# Altium schematic sheet AMPURR.SchDoc: =DocumentName
size 420 x 297 mm; CompanyName: "AS Manufacturing" LLC; Organization: "AS Manufacturing" LLC; Address1: 5 Sklyarenka St.; Address2: Kyiv 04073; Address3: Ukraine; Address4: https://ajax.systems/en/; DocumentNumber: 3; SheetNumber: 3; SheetTotal: 6; Template_version: 1.0.1
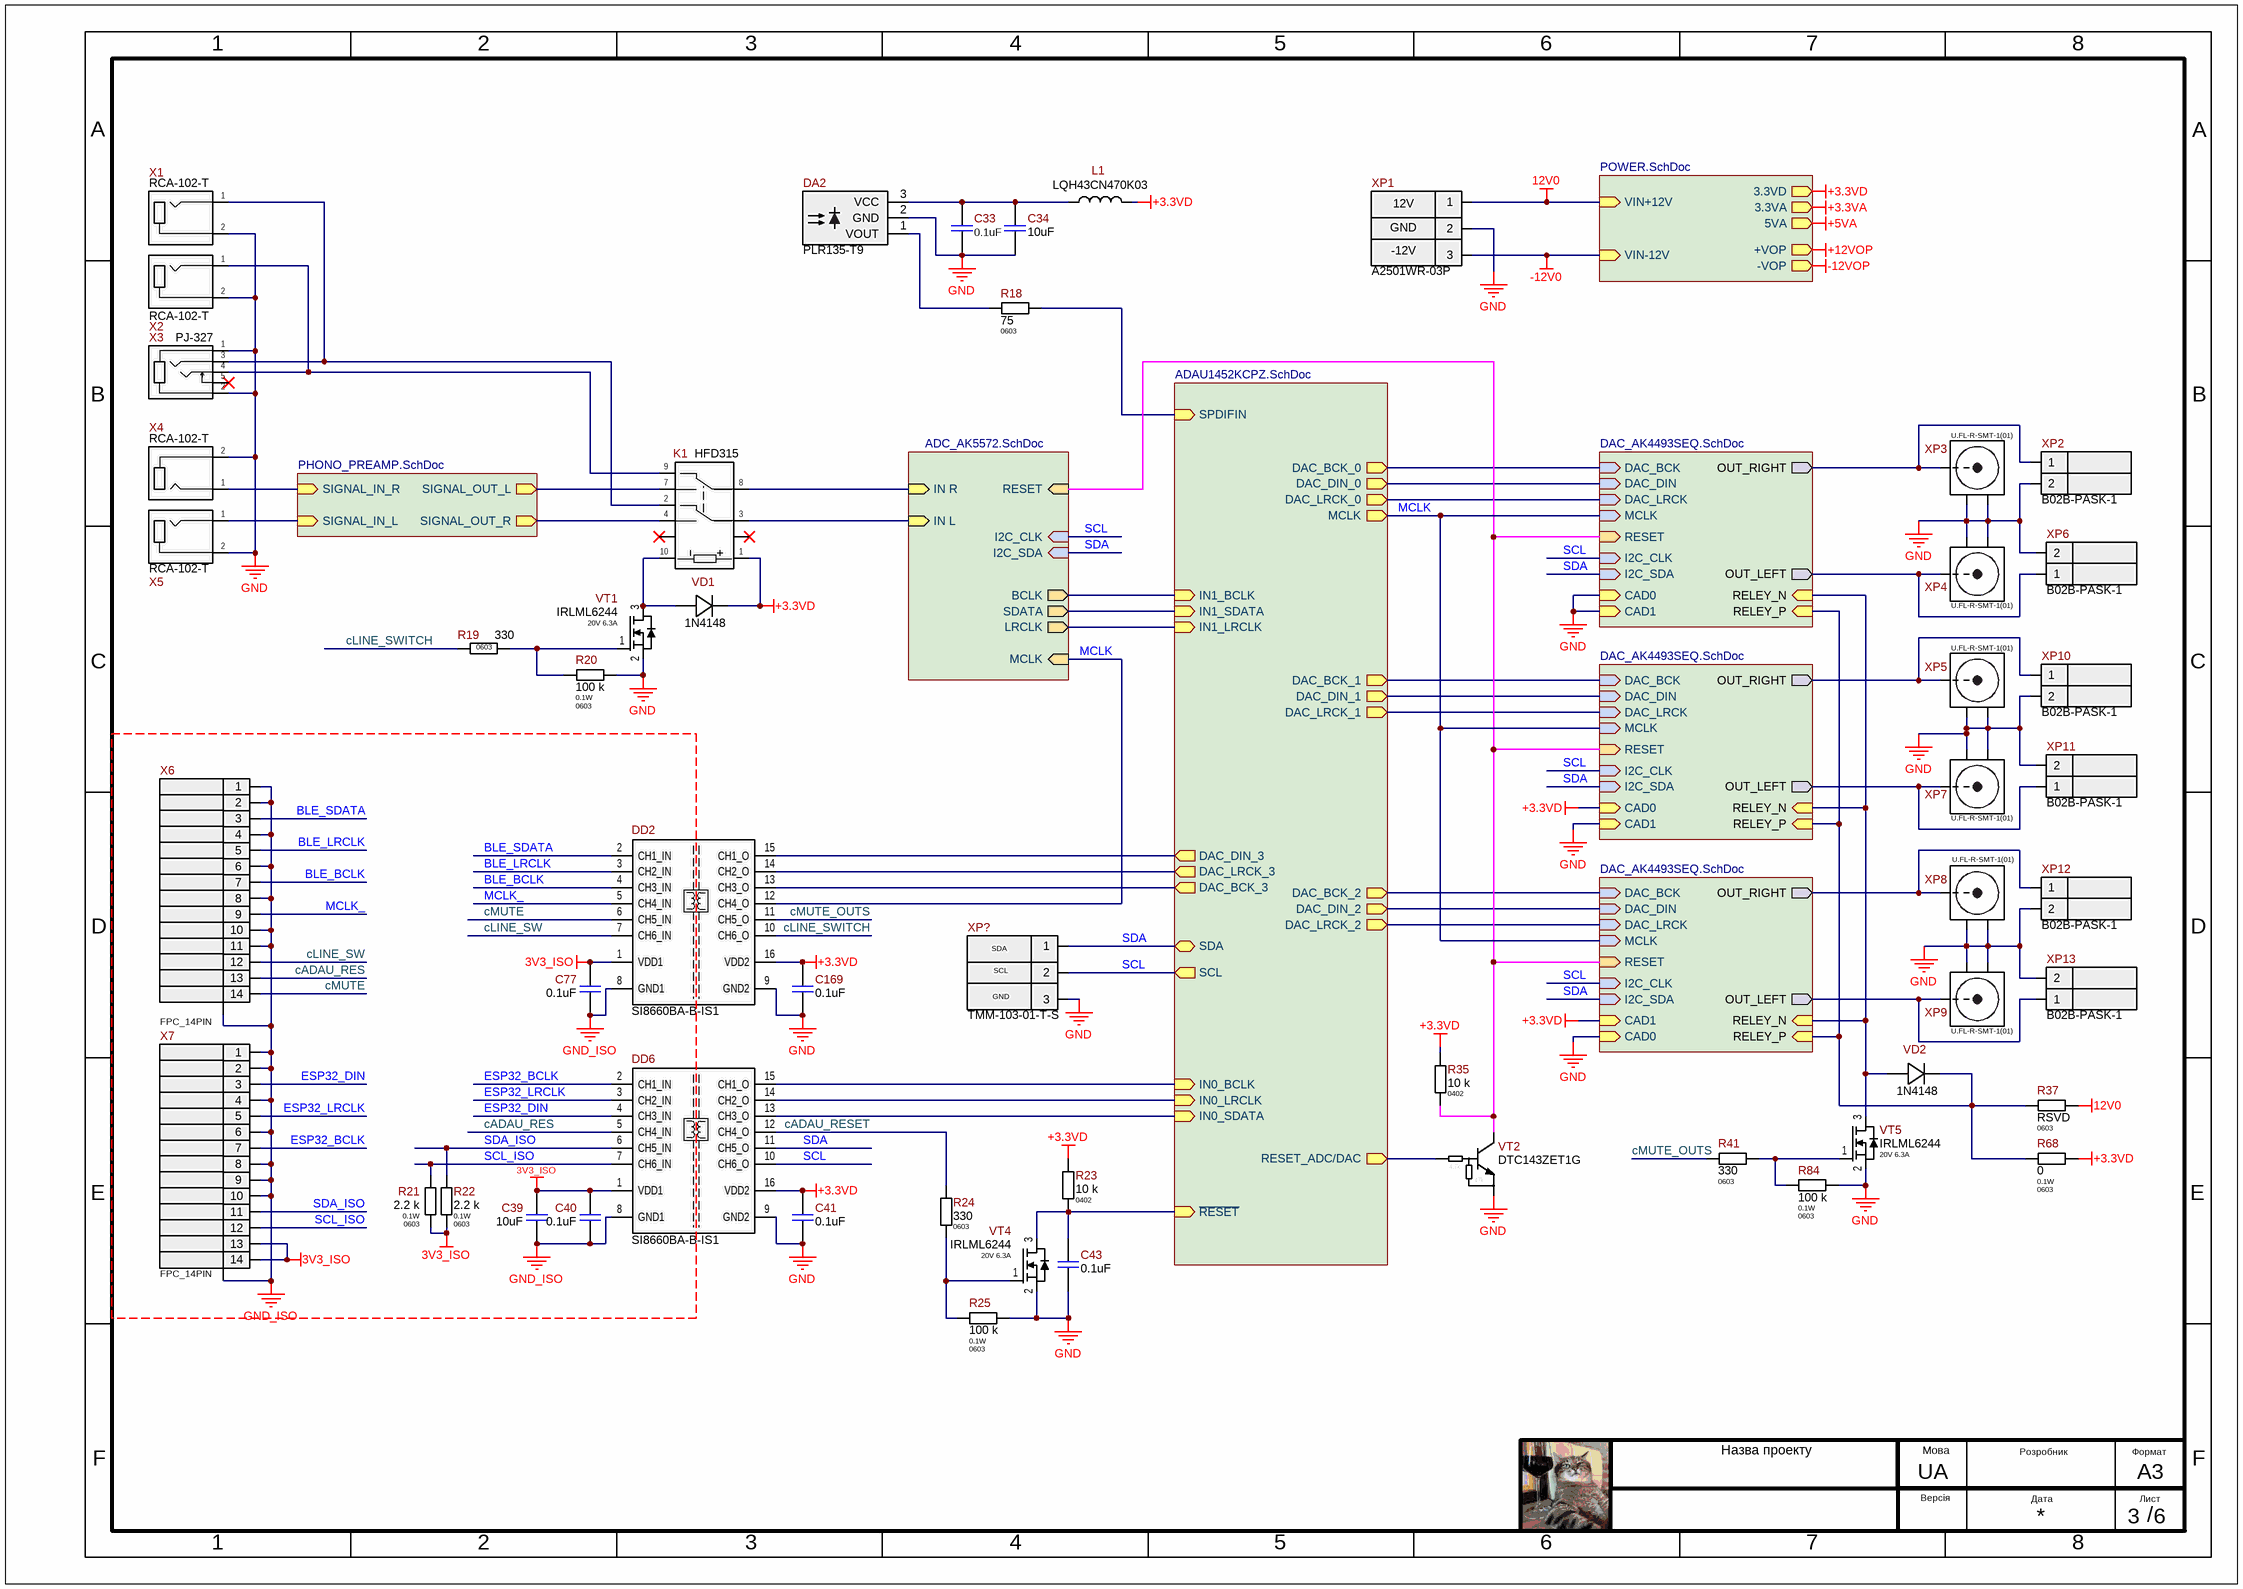
[diagram p0: AMPURR.SchDoc]

## Parts
C33  0.1uF  [C0603(1608)]
C34  10uF  [C0603(1608)]
C39  10uF  [C0402(1005)]
C40  0.1uF  [C0402(1005)]
C41  0.1uF  [C0402(1005)]
C43  0.1uF  [C0402(1005)]
C77  0.1uF  [C0402(1005)]
C169  0.1uF  [C0402(1005)]
DA2  PLR135-T9  [PLR135-T9]
DD2  SI8660BA-B-IS1  [SOIC-16]
DD6  SI8660BA-B-IS1  [SOIC-16]
K1  HFD315  [HFD315]
L1  LQH43CN470K03  [LQH43C]
R18  75  Package/Case: 0603  [R0603]
R19  330  Package/Case: 0603  [R0603]
R20  100 k  Power Rating: 0.1W  Package/Case: 0603  [R0603]
R21  2.2 k  Power Rating: 0.1W  Package/Case: 0603  [R0603]
R22  2.2 k  Power Rating: 0.1W  Package/Case: 0603  [R0603]
R23  10 k  Package/Case: 0402  [R0402]
R24  330  Package/Case: 0603  [R0603]
R25  100 k  Power Rating: 0.1W  Package/Case: 0603  [R0603]
R35  10 k  Package/Case: 0402  [R0402]
R37  RSVD  Package/Case: 0603  [R0603]  (no BOM)
R41  330  Package/Case: 0603  [R0603]
R68  0  Power Rating: 0.1W  Package/Case: 0603  [R0603]
R84  100 k  Power Rating: 0.1W  Package/Case: 0603  [R0603]
VD1  1N4148  [D0805]
VD2  1N4148  [D0805]
VT1  IRLML6244  Power Rating: 20V 6.3A  [SOT-23]
VT2  DTC143ZET1G  [SOT-416]
VT4  IRLML6244  Power Rating: 20V 6.3A  [SOT-23]
VT5  IRLML6244  Power Rating: 20V 6.3A  [SOT-23]
X1  RCA-102-T  [RCA-102-T]
X2  RCA-102-T  [RCA-102-T]
X3  PJ-327  [PJ-327A]
X4  RCA-102-T  [RCA-102-T]
X5  RCA-102-T  [RCA-102-T]
X6  FPC_14PIN  [FPC-14-0.5mm]
X7  FPC_14PIN  [FPC-14-0.5mm]
XP1  A2501WR-03P  [A2501WR-03P]
XP2  B02B-PASK-1  [JST_B02B-PASK-1(LF)(SN)]
XP3  U.FL-R-SMT-1(01)  [IPEX_ RECE.20279.001E.01]
XP4  U.FL-R-SMT-1(01)  [IPEX_ RECE.20279.001E.01]
XP5  U.FL-R-SMT-1(01)  [IPEX_ RECE.20279.001E.01]
XP6  B02B-PASK-1  [JST_B02B-PASK-1(LF)(SN)]
XP7  U.FL-R-SMT-1(01)  [IPEX_ RECE.20279.001E.01]
XP8  U.FL-R-SMT-1(01)  [IPEX_ RECE.20279.001E.01]
XP9  U.FL-R-SMT-1(01)  [IPEX_ RECE.20279.001E.01]
XP10  B02B-PASK-1  [JST_B02B-PASK-1(LF)(SN)]
XP11  B02B-PASK-1  [JST_B02B-PASK-1(LF)(SN)]
XP12  B02B-PASK-1  [JST_B02B-PASK-1(LF)(SN)]
XP13  B02B-PASK-1  [JST_B02B-PASK-1(LF)(SN)]
XP?  TMM-103-01-T-S  [CON_3_Pitch_2mm_1_Rows]

## Sub-sheets
U_ADAU1452KCPZ = ADAU1452KCPZ.SchDoc: DAC_DIN_0 (out), DAC_BCK_0 (out), DAC_LRCK_0 (out), DAC_DIN_1 (out), DAC_BCK_1 (out), DAC_LRCK_1 (out), DAC_DIN_2 (out), DAC_BCK_2 (out), DAC_LRCK_2 (out), IN0_BCLK (in), IN0_LRCLK (in), IN0_SDATA (in), IN1_BCLK (in), IN1_LRCLK (in), IN1_SDATA (in), MCLK (out), SCL (out), SDA (bidir), ~{RESET} (in), SPDIFIN (in), RESET_ADC/DAC (out), DAC_DIN_3 (out), DAC_BCK_3 (out), DAC_LRCK_3 (out)
U_ADC_AK5572 = ADC_AK5572.SchDoc: MCLK (in), IN L (in), SDATA (out), LRCLK (out), BCLK (out), IN R (in), RESET (in), I2C_SDA (in), I2C_CLK (in)
U_DAC_AK4493SEQ = DAC_AK4493SEQ.SchDoc: DAC_BCK (in), DAC_DIN (in), DAC_LRCK (in), MCLK (in), OUT_RIGHT (out), OUT_LEFT (out), RESET (in), I2C_SDA (in), I2C_CLK (in), CAD0 (in), CAD1 (in), RELEY_N (in), RELEY_P (in)
U_DAC_AK4493SEQ = DAC_AK4493SEQ.SchDoc: DAC_BCK (in), DAC_DIN (in), DAC_LRCK (in), MCLK (in), OUT_RIGHT (out), OUT_LEFT (out), RESET (in), I2C_SDA (in), I2C_CLK (in), CAD0 (in), CAD1 (in), RELEY_N (in), RELEY_P (in)
U_DAC_AK4493SEQ = DAC_AK4493SEQ.SchDoc: DAC_BCK (in), DAC_DIN (in), DAC_LRCK (in), MCLK (in), OUT_RIGHT (out), OUT_LEFT (out), RESET (in), I2C_SDA (in), I2C_CLK (in), CAD0 (in), CAD1 (in), RELEY_N (in), RELEY_P (in)
U_PHONO_PREAMP = PHONO_PREAMP.SchDoc: SIGNAL_IN_R (in), SIGNAL_OUT_R (out), SIGNAL_IN_L (in), SIGNAL_OUT_L (out)
U_POWER = POWER.SchDoc: +VOP (out), -VOP (out), 5VA (out), 3.3VA (out), 3.3VD (out), VIN+12V (in), VIN-12V (in)

## Nets
3V3_ISO: C39.2 C40.2 C77.2 DD2.1(VDD1) DD6.1(VDD1) R21.1 R22.1 X7.13 X7.14
12V0: R37.2 XP1.1 ; sheet U_POWER/VIN+12V
+3.3VA: sheet U_POWER/3.3VA
+3.3VD: C41.2 C169.2 DD2.16(VDD2) DD6.16(VDD2) K1.1(Coil+) L1.2 R23.2 R35.2 R68.2 VD1.1(K) ; sheet U_POWER/3.3VD, sheet U_DAC_AK4493SEQ/CAD0, sheet U_DAC_AK4493SEQ/CAD1
+5VA: sheet U_POWER/5VA
+12VOP: sheet U_POWER/+VOP
-12V0: XP1.3 ; sheet U_POWER/VIN-12V
-12VOP: sheet U_POWER/-VOP
GND: C33.2 C34.2 C41.1 C43.2 C169.1 DA2.2(GND) DD2.9(GND2) DD6.9(GND2) R20.1 R25.2 R84.1 VT1.2(S) VT2.2(E) VT4.2(S) VT5.2(S) X1.2(GND) X2.2(GND) X3.1(GND) X3.2(GND) X4.2(GND) X5.2(GND) XP1.2 XP2.2 XP3.2 XP3.3 XP4.2 XP4.3 XP5.2 XP5.3 XP6.2 XP7.2 XP7.3 XP8.2 XP8.3 XP9.2 XP9.3 XP10.2 XP11.2 XP12.2 XP13.2 XP?.3 ; sheet U_DAC_AK4493SEQ/CAD0, sheet U_DAC_AK4493SEQ/CAD1, sheet U_DAC_AK4493SEQ/CAD1, sheet U_DAC_AK4493SEQ/CAD0
GND_ISO: C39.1 C40.1 C77.1 DD2.8(GND1) DD6.8(GND1) X6.1 X6.2 X6.4 X6.6 X6.8 X6.10 X6.11 X6.15 X7.1 X7.2 X7.4 X7.6 X7.8 X7.9 X7.10 X7.15
BLE_BCLK: DD2.4(CH3_IN) X6.7
BLE_LRCLK: DD2.3(CH2_IN) X6.5
BLE_SDATA: DD2.2(CH1_IN) X6.3
cADAU_RES: DD6.5(CH4_IN) X6.13
cADAU_RESET: DD6.12(CH4_O) R24.2
cLINE_SW: DD2.7(CH6_IN) X6.12
cLINE_SWITCH: DD2.10(CH6_O) R19.1
cMUTE: DD2.6(CH5_IN) X6.14
cMUTE_OUTS: DD2.11(CH5_O) R41.1
ESP32_BCLK: DD6.2(CH1_IN) X7.7
ESP32_DIN: DD6.4(CH3_IN) X7.3
ESP32_LRCLK: DD6.3(CH2_IN) X7.5
MCLK: DD2.12(CH4_O) ; sheet U_ADC_AK5572/MCLK, sheet U_ADAU1452KCPZ/MCLK, sheet U_DAC_AK4493SEQ/MCLK, sheet U_DAC_AK4493SEQ/MCLK, sheet U_DAC_AK4493SEQ/MCLK
MCLK_: DD2.5(CH4_IN) X6.9
SCL: DD6.10(CH6_O) XP?.2 ; sheet U_ADC_AK5572/I2C_CLK, sheet U_ADAU1452KCPZ/SCL, sheet U_DAC_AK4493SEQ/I2C_CLK, sheet U_DAC_AK4493SEQ/I2C_CLK, sheet U_DAC_AK4493SEQ/I2C_CLK
SCL_ISO: DD6.7(CH6_IN) R21.2 X7.12
SDA: DD6.11(CH5_O) XP?.1 ; sheet U_ADC_AK5572/I2C_SDA, sheet U_ADAU1452KCPZ/SDA, sheet U_DAC_AK4493SEQ/I2C_SDA, sheet U_DAC_AK4493SEQ/I2C_SDA, sheet U_DAC_AK4493SEQ/I2C_SDA
SDA_ISO: DD6.6(CH5_IN) R22.2 X7.11
NetC33_1: C33.1 C34.1 DA2.3(VCC) L1.1
NetC43_1: C43.1 R23.1 VT4.3(D) ; sheet U_ADAU1452KCPZ/~{RESET}
NetDA2_1: DA2.1(VOUT) R18.1
NetDD2_13: DD2.13(CH3_O) ; sheet U_ADAU1452KCPZ/DAC_BCK_3
NetDD2_14: DD2.14(CH2_O) ; sheet U_ADAU1452KCPZ/DAC_LRCK_3
NetDD2_15: DD2.15(CH1_O) ; sheet U_ADAU1452KCPZ/DAC_DIN_3
NetDD6_13: DD6.13(CH3_O) ; sheet U_ADAU1452KCPZ/IN0_SDATA
NetDD6_14: DD6.14(CH2_O) ; sheet U_ADAU1452KCPZ/IN0_LRCLK
NetDD6_15: DD6.15(CH1_O) ; sheet U_ADAU1452KCPZ/IN0_BCLK
NetK1_2: K1.2(1-CLOSED) X1.1(GND) X3.3(GND)
NetK1_3: K1.3(1-COM) ; sheet U_ADC_AK5572/IN L
NetK1_4: K1.4(1-OPEN) ; sheet U_PHONO_PREAMP/SIGNAL_OUT_R
NetK1_7: K1.7(2-OPEN) ; sheet U_PHONO_PREAMP/SIGNAL_OUT_L
NetK1_8: K1.8(2-COM) ; sheet U_ADC_AK5572/IN R
NetK1_9: K1.9(2-OPEN) X2.1(GND) X3.4(GND)
NetK1_10: K1.10(Coil-) VD1.2(A) VT1.3(D)
NetR18_2: R18.2 ; sheet U_ADAU1452KCPZ/SPDIFIN
NetR19_2: R19.2 R20.2 VT1.1(G)
NetR24_1: R24.1 R25.1 VT4.1(G)
NetR35_1: R35.1 VT2.3(C) ; sheet U_ADC_AK5572/RESET, sheet U_DAC_AK4493SEQ/RESET, sheet U_DAC_AK4493SEQ/RESET, sheet U_DAC_AK4493SEQ/RESET
NetR37_1: R37.1 R68.1 VD2.1(K) ; sheet U_DAC_AK4493SEQ/RELEY_P, sheet U_DAC_AK4493SEQ/RELEY_P, sheet U_DAC_AK4493SEQ/RELEY_P
NetR41_2: R41.2 R84.2 VT5.1(G)
NetVD2_2: VD2.2(A) VT5.3(D) ; sheet U_DAC_AK4493SEQ/RELEY_N, sheet U_DAC_AK4493SEQ/RELEY_N, sheet U_DAC_AK4493SEQ/RELEY_N
NetVT2_1: VT2.1(B) ; sheet U_ADAU1452KCPZ/RESET_ADC/DAC
NetX4_1: X4.1(GND) ; sheet U_PHONO_PREAMP/SIGNAL_IN_R
NetX5_1: X5.1(GND) ; sheet U_PHONO_PREAMP/SIGNAL_IN_L
NetXP2_1: XP2.1 XP3.1 ; sheet U_DAC_AK4493SEQ/OUT_RIGHT
NetXP4_1: XP4.1 XP6.1 ; sheet U_DAC_AK4493SEQ/OUT_LEFT
NetXP5_1: XP5.1 XP10.1 ; sheet U_DAC_AK4493SEQ/OUT_RIGHT
NetXP7_1: XP7.1 XP11.1 ; sheet U_DAC_AK4493SEQ/OUT_LEFT
NetXP8_1: XP8.1 XP12.1 ; sheet U_DAC_AK4493SEQ/OUT_RIGHT
NetXP9_1: XP9.1 XP13.1 ; sheet U_DAC_AK4493SEQ/OUT_LEFT
(unnamed): sheet U_ADC_AK5572/SDATA, sheet U_ADAU1452KCPZ/IN1_SDATA
(unnamed): sheet U_ADC_AK5572/LRCLK, sheet U_ADAU1452KCPZ/IN1_LRCLK
(unnamed): sheet U_ADC_AK5572/BCLK, sheet U_ADAU1452KCPZ/IN1_BCLK
(unnamed): sheet U_ADAU1452KCPZ/DAC_DIN_0, sheet U_DAC_AK4493SEQ/DAC_DIN
(unnamed): sheet U_ADAU1452KCPZ/DAC_BCK_0, sheet U_DAC_AK4493SEQ/DAC_BCK
(unnamed): sheet U_ADAU1452KCPZ/DAC_LRCK_0, sheet U_DAC_AK4493SEQ/DAC_LRCK
(unnamed): sheet U_ADAU1452KCPZ/DAC_DIN_1, sheet U_DAC_AK4493SEQ/DAC_DIN
(unnamed): sheet U_ADAU1452KCPZ/DAC_BCK_1, sheet U_DAC_AK4493SEQ/DAC_BCK
(unnamed): sheet U_ADAU1452KCPZ/DAC_LRCK_1, sheet U_DAC_AK4493SEQ/DAC_LRCK
(unnamed): sheet U_ADAU1452KCPZ/DAC_DIN_2, sheet U_DAC_AK4493SEQ/DAC_DIN
(unnamed): sheet U_ADAU1452KCPZ/DAC_BCK_2, sheet U_DAC_AK4493SEQ/DAC_BCK
(unnamed): sheet U_ADAU1452KCPZ/DAC_LRCK_2, sheet U_DAC_AK4493SEQ/DAC_LRCK

Not connected (* = marked no-connect by the designer): K1 5* 6*; X3 5(GND)*

## Notes on the sheet
- (near XP1) 12V
- (near XP1) -12V
- (near XP1) GND
- (near XP?) SDA
- (near XP?) GND
- (near XP?) SCL
- 1
- 2
- 3
- 4
- 5
- 6
- 7
- 8
- A
- B
- C
- D
- E
- F
- Назва проекту
- Мова
- UA
- Розробник
- Формат
- A3
- Версія
- Дата
- Лист
- /
- (in symbol DTC143ZET1G) 4.7k; 47k

## Library data of the parts
C33 = 0.1uF  50V C0603: CAP CER 0.1UF 50V X7R 0603; Manufacturer: Samsung Electro-Mechanics; Manufacturer P/N: CL10B104KB8WPNC; Name Component: Capacitor Ceramic; Tolerance: ±10%; Operation Temperature: -55°C ~ 125°C; Library Path 1: Capacitors.SchLib; Notes: 06035C104K4T4A, 06035C104K4T2A; Part Number: 0.1uF  50V C0603; Value: 0.1uF; Temperature Coefficient: X7R; Power (V/A): 50V; Package/Case: C0603; Supplier Part Number 1: 1276-6854-2-ND; ComponentLink1Description: Datasheet; Supplier 1: Digi-key; ComponentLink1URL: https://www.samsungsem.com/resources/file/global/support/product_catalog/MLCC.pdf
C34 = 10uF  35V C0603: CAP CER 10UF 35V X5R 0603; Manufacturer: Murata Electronics North America; Manufacturer P/N: GRM188R6YA106MA73D; Name Component: Capacitor Ceramic; Tolerance: ±20%; Operation Temperature: -55°C ~ 105°C; Library Path 1: Capacitors.SchLib; Part Number: 10uF  35V C0603; Value: 10uF; Temperature Coefficient: X5R; Power (V/A): 35V; Package/Case: C0603; Supplier Part Number 1: 490-13248-2-ND; ComponentLink1Description: Datasheet; Supplier 1: Digi-key; ComponentLink1URL: https://search.murata.co.jp/Ceramy/image/img/A01X/G101/ENG/GRM188R6YA106MA73-01.pdf
C39 = 10uF  6.3V C0402: CAP CER 10UF 6.3V X6S 0402; Manufacturer: Murata Electronics North America; Manufacturer P/N: GRM155C80J106ME11D; Name Component: Capacitor Ceramic; Tolerance: ±20%; Operation Temperature: -55°C ~ 105°C; Library Path 1: Capacitors.SchLib; Part Number: 10uF  6.3V C0402; Value: 10uF; Temperature Coefficient: X6S; Power (V/A): 6.3V; Package/Case: C0402; Supplier 1: Digi-key; Supplier Part Number 1: 490-13233-2-ND; ComponentLink1Description: Datasheet; ComponentLink1URL: https://www.murata.com/~/media/webrenewal/support/library/catalog/products/capacitor/mlcc/c02e.ashx?la=en-us
C40 C41 C43 C77 C169 = 0.1uF  25V C0403: CAP CER 0.1UF 25V X7R 0603; Manufacturer: Samsung Electro-Mechanics; Name Component: Capacitor Ceramic; Tolerance: ±10%; Operation Temperature: -55°C ~ 125°C; Library Path 1: Capacitors.SchLib; Part Number: 0.1uF  25V C0403; Value: 0.1uF; Temperature Coefficient: X7R; Power (V/A): 25V; Package/Case: C0403; Supplier Part Number 1: 1276-6854-2-ND; ComponentLink1Description: Datasheet
DA2 = PLR135-T9: Fiber Optic Receiver General Data Transfer 16Mbps -27dBm 2.4V ~ 5.5V 12 mA; Manufacturer: Everlight Electronics Co Ltd; Name Component: Fiber Optic Receivers; Library Path 1: Opto.SchLib; Part Number: PLR135-T9; Value: PLR135-T9; Power (V/A): 2.4V ~ 5.5V; Package/Case: PLR135; Manufacturer P/N: PLR135-T9; Supplier 1: Digi-key; ComponentLink1Description: Datasheet; ComponentLink1URL: https://mm.digikey.com/Volume0/opasdata/d220001/medias/docus/6601/PLR135_T9.pdf
DD2 DD6 = SI8660BA-B-IS1: General Purpose Digital Isolator 1000Vrms 6 Channel 150Mbps 35kV/µs CMTI 16-SOIC (0.154", 3.90mm Width); Manufacturer: Skyworks Solutions Inc.; Name Component: ISOLATOR I2S; Operation Temperature: -40°C ~ 125°C; Power (V/A): 2.5V ~ 5.5V; Library Path 1: Integrated Circuit.SchLib; Part Number: SI8660BA-B-IS1; Value: SI8660BA-B-IS1; Package/Case: 16-SOIC; Manufacturer P/N: SI8660BA-B-IS1; Supplier 1: Digi-key; Supplier Part Number 1: 336-2115-5-ND; ComponentLink1Description: Datasheet; ComponentLink1URL: https://eu.mouser.com/datasheet/2/472/si866x-2507613.pdf
K1 = HFD315: Signal Relay 5VDC 2A DPDT(14x9x5.4)mm THT; Manufacturer_Name: Hongfa; Manufacturer_Part_Number: HFD31/5; Power (V/A): 2A 30V; Library Path 1: Others.SchLib; Datasheet Link: https://source.hongfa.com//Api/DownloadPdf/152; Height: 5.4mm; Arrow Part Number: HFD31/5; Arrow Price/Stock: https://www.arrow.com/en/products/hfd315/hongfa-europe-gmbh?region=europe; Part Number: HFD315; Name Component: Relay; Value: HFD315; Manufacturer: HONGFA; Supplier 1: RCS; ComponentLink1Description: Datasheet; ComponentLink1URL: https://static6.arrow.com/aropdfconversion/b1e7c006847c6f4b4ecbb9dbc4d2a4bf4dbb2da6/hfd31.pdf
L1 = LQH43CN470K03: FIXED IND 47UH 280MA 1.1 OHM SMD; Manufacturer: MurataElectronics; Manufacturer P/N: LQH43CN470K03L; Name Component: Fixed Inductors; Tolerance: ±10; Operation Temperature: -40°C ~ 85°C; Library Path 1: Inductance.SchLib; Power (V/A): 0.28 A; Part Number: LQH43CN470K03; Value: LQH43CN470K03; Supplier 1: Digi-key; Supplier Part Number 1: 490-2521-2-ND; ComponentLink1Description: Datasheet; ComponentLink1URL: https://search.murata.co.jp/Ceramy/image/img/P02/JELF243A-0042.pdf
R18 = 10 k  R0603: RES SMD 10 k OHM  ±1% 1/10W 0603; Power Rating: 0.1W; Name Component: Resistror; Value: 10 k; Operation Temperature: -55℃ to 155℃; Temperature Coefficient: ±100 ppm/°C; Library Path 1: Resistor.SchLib; Part Number: 10 k  R0603; Tolerance: ±1%
R19 R24 R41 = 330  R0603: RES SMD 330 OHM  ±1% 1/10W 0603; Power Rating: 0.1W; Name Component: Resistror; Operation Temperature: -55℃ to 155℃; Temperature Coefficient: ±100 ppm/°C; Library Path 1: Resistor.SchLib; Part Number: 330  R0603; Value: 330; Tolerance: ±1%
R20 R25 R84 = 100 k  R0603: RES SMD 100 k OHM  ±1% 1/10W 0603; Name Component: Resistror; Operation Temperature: -55℃ to 155℃; Temperature Coefficient: ±100 ppm/°C; Library Path 1: Resistor.SchLib; Part Number: 100 k  R0603; Value: 100 k; Tolerance: ±1%
R21 R22 = 2.2 k  R0603: RES SMD 2.2 k OHM  ±1% 1/10W 0603; Name Component: Resistror; Operation Temperature: -55℃ to 155℃; Temperature Coefficient: ±100 ppm/°C; Library Path 1: Resistor.SchLib; Part Number: 2.2 k  R0603; Value: 2.2 k; Tolerance: ±1%
R23 R35 = 10 k  R0402: RES SMD 10 k OHM  ±1% 1/16W 0402; Power Rating: 0.063W; Name Component: Resistror; Operation Temperature: -55℃ to 155℃; Temperature Coefficient: ±100 ppm/°C; Library Path 1: Resistor.SchLib; Part Number: 10 k  R0402; Value: 10 k; Tolerance: ±1%
R37 = RSVD  R0603: RES SMD RSVD OHM  NC 1/16W 0402; Name Component: Resistror; Operation Temperature: -55℃ to 155℃; Temperature Coefficient: ±200 ppm/°C; Library Path 1: Resistor.SchLib; Part Number: RSVD  R0603; Value: RSVD; Tolerance: NC
R68 = 0  R0603: RES SMD 0 OHM  ±1% 1/10W 0603; Part Number: 0  R0603; Name Component: Resistror; Operation Temperature: -55℃ to 155℃; Temperature Coefficient: ±200 ppm/°C; Library Path 1: Resistor.SchLib; Value: 0; Tolerance: ±1%
VD1 VD2 = 1N4148: DIODE GEN PURP 75V 250MA SOD323; Manufacturer: Diodes Incorporated; Operation Temperature: -55°C ~ 150°C; Library Path 1: Diodes.SchLib; Power Rating: 75V 250mA; Part Number: 1N4148; Name Component: Diode; Value: 1N4148; Package/Case: SOD-80; Manufacturer P/N: 1N4148; Supplier 1: Digi-key; Supplier Part Number 1: 1N4148; ComponentLink1Description: Datasheet
VT1 VT4 VT5 = IRLML6244: MOSFET N-CH 20V 6.3A SOT-23; Manufacturer: InfineonTechnologies; Manufacturer P/N: IRLML6244TRPBF; Name Component: Transistor; Operation Temperature: -55°C ~ 150°C (TJ); Library Path 1: Transistors.SchLib; ComponentLink1URL: https://www.infineon.com/dgdl/irlml6244pbf.pdf?fileId=5546d462533600a4015356686fed261f; ComponentLink1Description: Datasheet; Part Number: IRLML6244; Value: IRLML6244; Package/Case: SOT-23; Supplier 1: Digi-key; Supplier Part Number 1: IRLML6244TRPBFTR-ND
VT2 = DTC143ZET1G: TRANS PREBIAS NPN 50V 100MA SC75; Manufacturer: onsemi; Name Component: Transistor; Operation Temperature: -55°C ~ 150°C (TJ); Power Rating: 100mA 50V; Library Path 1: Transistors.SchLib; Part Number: DTC143ZET1G; Value: DTC143ZET1G; Package/Case: SOT-416; Manufacturer P/N: DTC143ZET1G; Supplier 1: Digi-key; Supplier Part Number 1: DTC143ZET1GOSTR-ND; ComponentLink1Description: Datasheet; ComponentLink1URL: https://www.onsemi.com/pdf/datasheet/dtc143z-d.pdf
X1 X2 X4 X5 = RCA-102-T: Name Component: RSA; Library Path 1: Connectors.SchLib; Part Number: RCA-102-T; Value: RCA-102-T; Supplier 1: Kosmodrom; ComponentLink1Description: Datasheet; ComponentLink1URL: http://www.kosmodrom.com.ua/pdf/RCA-102.pdf
X3 = PJ-327: 3.5 Audio Jack SMD; Manufacturer_Name: Hongfa; Manufacturer_Part_Number: HFD31/5; Library Path 1: Connectors.SchLib; Datasheet Link: https://source.hongfa.com//Api/DownloadPdf/152; Height: 5.4mm; Arrow Part Number: HFD31/5; Arrow Price/Stock: https://www.arrow.com/en/products/hfd315/hongfa-europe-gmbh?region=europe; Part Number: PJ-327; Name Component: Audio Jack; Value: PJ-327; Supplier 1: Kosmodrom; ComponentLink1Description: Datasheet; ComponentLink1URL: https://e2e.ti.com/cfs-file/__key/communityserver-discussions-components-files/6/2.5_2D00_3.5_2D00_phone_2D00_jack.pdf
X6 X7 = FPC_14PIN: FPC CONNECTOR; Library Path 1: Connectors.SchLib; Part Number: FPC_14PIN; Name Component: FPC_14PIN; Value: FPC_14PIN; ComponentLink1Description: Datasheet
XP1 = A2501WR-03P: PIN: 3; A2501; 3A; 250V; UL94V-0; Manufacturer: JOINT TECH; Name Component: Power Connectors; Operation Temperature: -40°C ~ 80°C; Library Path 1: Connectors.SchLib; Part Number: A2501WR-03P; Value: A2501WR-03P; Supplier 1: RCS; ComponentLink1Description: Datasheet; ComponentLink1URL: https://documents.tme.eu/v7/_solaris-tep_/pVersion=0046&contRep=ZT&docId=005056AB752F1EE383C6617DFE942CAD&compId=A2501WV-XP.pdf?ci_sign=9baf55e1d4ede3a69cd97522aa56fece6c405150
XP2 XP6 XP10-XP13 = B02B-PASK-1: CONN HEADER VERT 2POS 2MM; Manufacturer: JST Sales America Inc.; Manufacturer P/N: B02B-PASK-1(LF)(SN); Name Component: Rectangular Connectors - Headers; Operation Temperature: -55 °C to +105 °C; Power (V/A): 3A; Library Path 1: Connectors.SchLib; Part Number: B02B-PASK-1; Value: B02B-PASK-1; Package/Case: 2mm; Supplier 1: Digi-key; ComponentLink1Description: Datasheet; ComponentLink1URL: http://www.jst-mfg.com/product/pdf/eng/ePA-F.pdf
XP3-XP5 XP7-XP9 = U.FL-R-SMT-1(01): CONN UMC RCPT STR 50 OHM SMD; Manufacturer: HIROSE; Name Component: U.FL (IPX/AMC); Operation Temperature: -10°C …. 40°C; Library Path 1: Connectors.SchLib; System: Connector; Part Number: U.FL-R-SMT-1(01); Value: U.FL-R-SMT-1(01); Package/Case: Male Pin; Manufacturer P/N: U.FL-R-SMT-1(01); Supplier 1: TME; ComponentLink1Description: Datasheet; ComponentLink1URL: https://www.tme.eu/ua/ru/details/u.fl-r-smt-1-01/mikrorazemy/hirose/u-fl-r-smt-1-01/
XP? = TMM-103-01-T-S: CONN HEADER VERT 3POS 2MM; Manufacturer: Samtec Inc.; Name Component: Rectangular Connectors - Headers; Operation Temperature: -55 °C to +105 °C; Power (V/A): 3.2A; Library Path 1: Connectors.SchLib; Part Number: TMM-103-01-T-S; Value: TMM-103-01-T-S; Package/Case: 2mm; Manufacturer P/N: TMM-103-01-T-S; Supplier 1: Digi-key; ComponentLink1Description: Datasheet; ComponentLink1URL: http://suddendocs.samtec.com/catalog_english/tmm_th.pdf